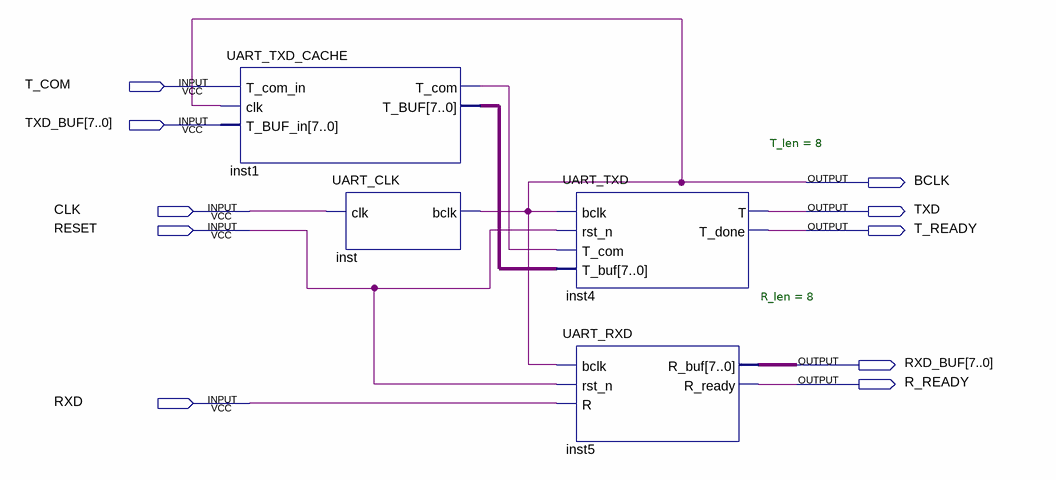
[diagram p0: schematic sheet]
// Quartus schematic UART_BLOCK.bdf as structural Verilog: 4 symbols, 10 pins
module UART_BLOCK (
  input  T_COM,
  input  [7:0] TXD_BUF,
  input  CLK,
  input  RESET,
  input  RXD,
  output BCLK,
  output TXD,
  output T_READY,
  output [7:0] RXD_BUF,
  output R_READY
);

  wire inst1_t_com;
  wire [7:0] inst1_t_buf;

  UART_TXD_CACHE inst1 (.T_com_in(T_COM), .clk(BCLK), .T_BUF_in(TXD_BUF), .T_com(inst1_t_com), .T_BUF(inst1_t_buf));
  UART_CLK inst (.clk(CLK), .bclk(BCLK));
  UART_TXD #(.T_len(8)) inst4 (
    .bclk(BCLK), .rst_n(RESET), .T_com(inst1_t_com), .T_buf(inst1_t_buf), .T(TXD), .T_done(T_READY));
  UART_RXD #(.R_len(8)) inst5 (.bclk(BCLK), .rst_n(RESET), .R(RXD), .R_buf(RXD_BUF), .R_ready(R_READY));
endmodule
